# EAGLE design riffle-x9 (EAGLE 7.5.0)
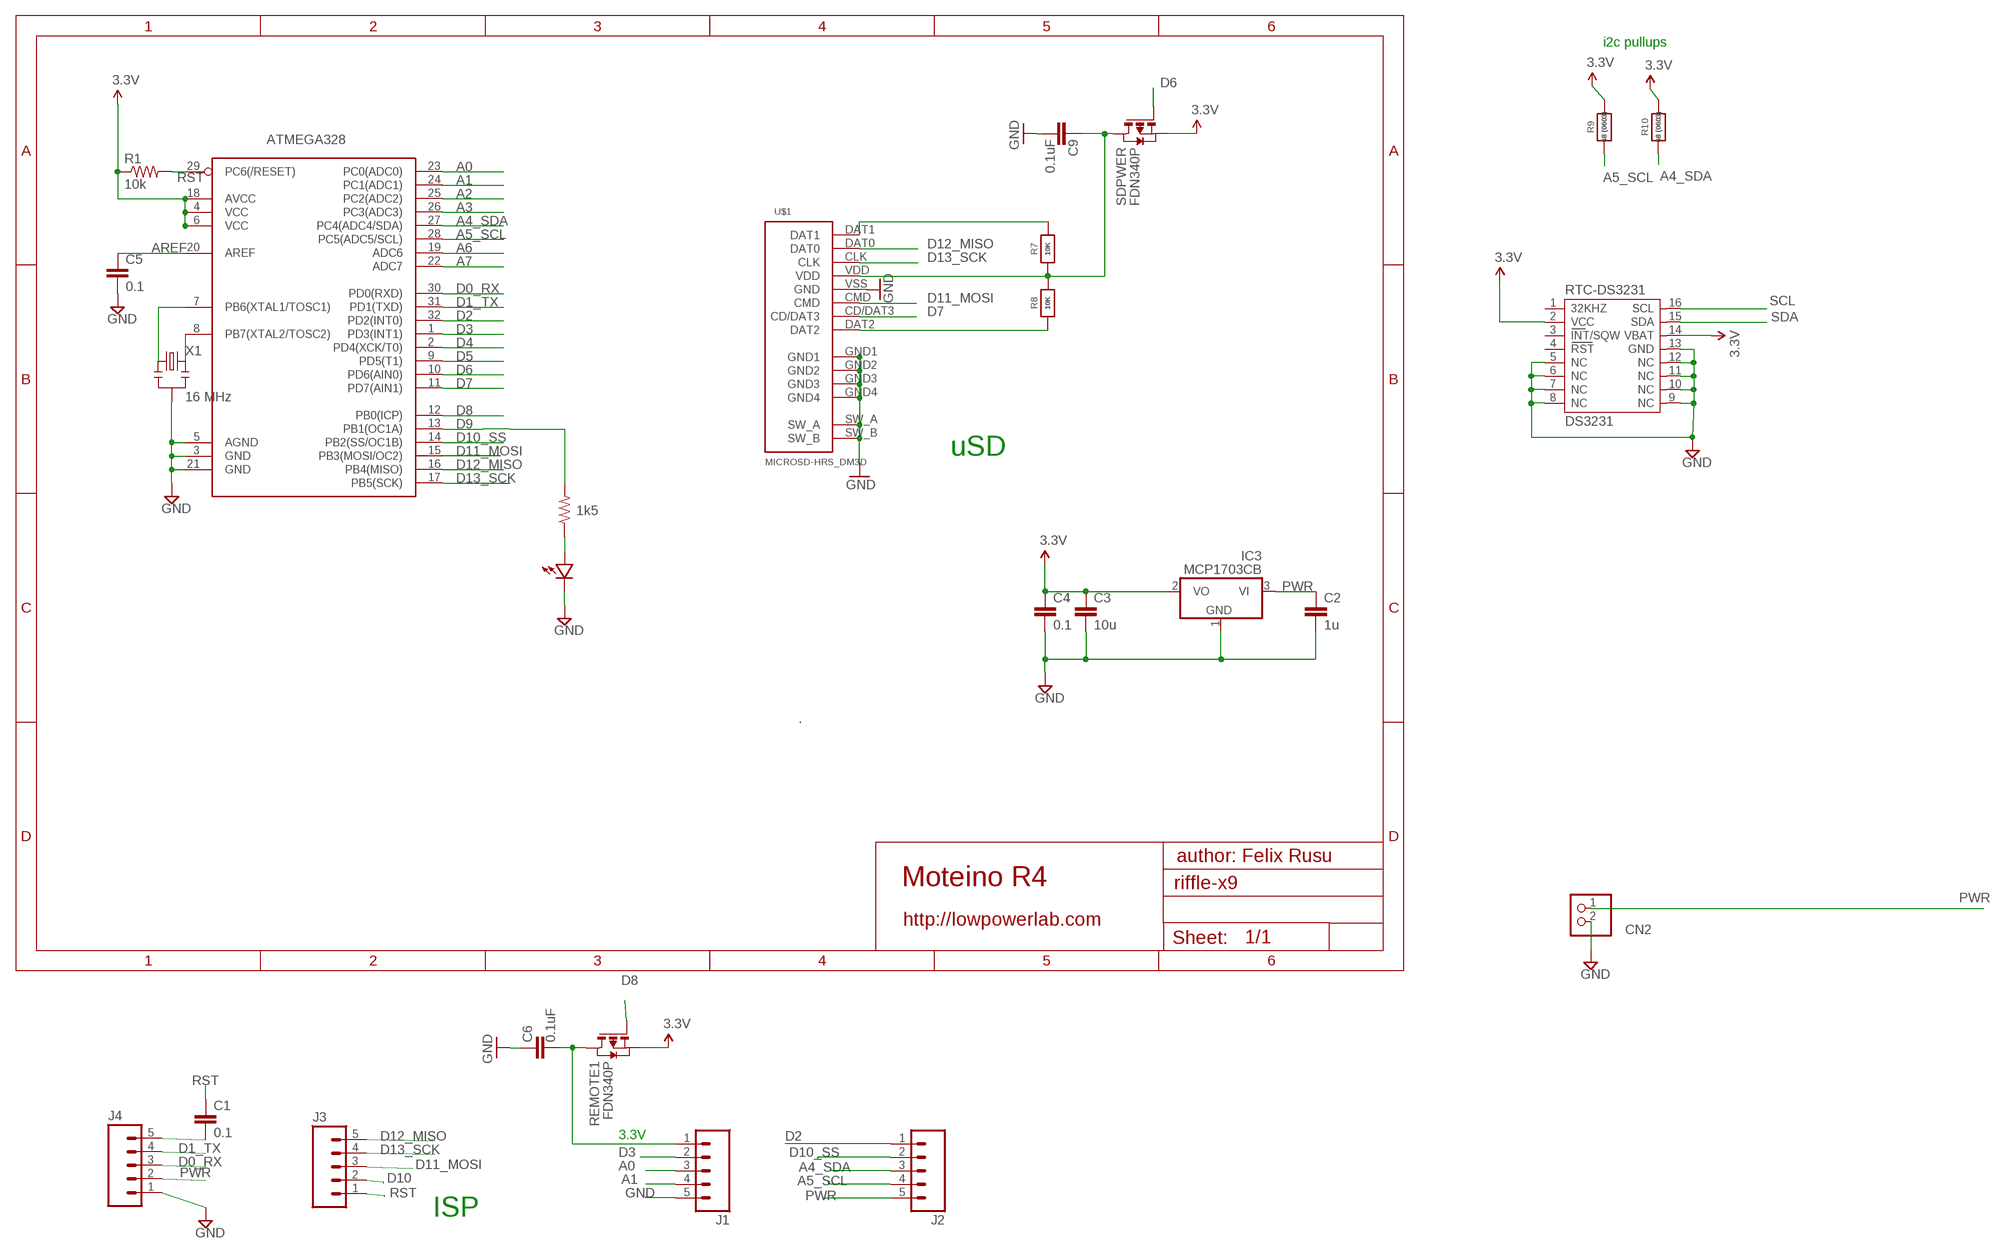
[diagram p0: schematic, sheet 1]

## Parts
ATMEGA328  ATMega-328  ATMEGA168/328TQFP32  [TQFP32-08]
C1  0.1  CAP0603-CAP  [0603-CAP]
C2  1u  CAP0603-CAP  [0603-CAP]
C3  10u  CAP0805-CAP  [0805-CAP]
C4  0.1  CAP0603-CAP  [0603-CAP]
C5  0.1  CAP0603-CAP  [0603-CAP]
C6  0.1uF  CAP0603-CAP  [0603-CAP]
C9  0.1uF  CAP0603-CAP  [0603-CAP]
CN2  JST_2PIN-SMT-RA  [JST-PH-2-SMT-RA]
IC3  MCP1703CB  [SOT23]
J1  M051.27MM  [1X05-1.27MM]
J2  M051.27MM  [1X05-1.27MM]
J3  M051.27MM  [1X05-1.27MM]
J4  M051.27MM  [1X05-1.27MM]
R1  10k  RESISTOR0603-RES  [0603-RES]
R2  1k5  RESISTOR0603-RES  [0603-RES]
R7  10K  RESISTOR_0603_NOOUT  [0603-NO]
R8  10K  RESISTOR_0603_NOOUT  [0603-NO]
R9  68 (0603)  RESISTOR_0603_NOOUT  [0603-NO]
R10  68 (0603)  RESISTOR_0603_NOOUT  [0603-NO]
REMOTE1  FDN340P  PMOSSOT23  [SOT-23]
RTC-DS3231  DS3231  [DS3231]
SDPWER  FDN340P  PMOSSOT23  [SOT-23]
U$1  MICROSD-HRS_DM3D  [DM3D]
U$2  LED0603  [0603-LED]
X1  16 MHz  RESONATORSMD  [RESONATOR-SMD]

## Nets
A0: ATMEGA328.23(PC0(ADC0)) J1.3
A1: ATMEGA328.24(PC1(ADC1)) J1.4
A2: ATMEGA328.25(PC2(ADC2))
A3: ATMEGA328.26(PC3(ADC3))
A4_SDA: ATMEGA328.27(PC4(ADC4/SDA)) J2.3 R10.1
A5_SCL: ATMEGA328.28(PC5(ADC5/SCL)) J2.4 R9.1
A6: ATMEGA328.19(ADC6)
A7: ATMEGA328.22(ADC7)
AREF: ATMEGA328.20(AREF) C5.1
D0_RX: ATMEGA328.30(PD0(RXD)) J4.3
D1_TX: ATMEGA328.31(PD1(TXD)) J4.4
D2: ATMEGA328.32(PD2(INT0)) J2.1
D3: ATMEGA328.1(PD3(INT1)) J1.2
D4: ATMEGA328.2(PD4(XCK/T0))
D5: ATMEGA328.9(PD5(T1))
D6: ATMEGA328.10(PD6(AIN0)) SDPWER.3(G)
D7: ATMEGA328.11(PD7(AIN1)) U$1.CD/DAT3
D8: ATMEGA328.12(PB0(ICP)) REMOTE1.3(G)
D9: ATMEGA328.13(PB1(OC1A)) R2.2
D10: J3.2
D10_SS: ATMEGA328.14(PB2(SS/OC1B)) J2.2
D11_MOSI: ATMEGA328.15(PB3(MOSI/OC2)) J3.3 U$1.CMD
D12_MISO: ATMEGA328.16(PB4(MISO)) J3.5 U$1.DAT0
D13_SCK: ATMEGA328.17(PB5(SCK)) J3.4 U$1.CLK
GND [power]: ATMEGA328.3(GND) ATMEGA328.5(AGND) ATMEGA328.21(GND) C2.2 C3.2 C4.2 C5.2 C6.2 C9.1 CN2.2 IC3.1(GND) J1.5 J4.1 RTC-DS3231.5(NC) RTC-DS3231.6(NC) RTC-DS3231.7(NC) RTC-DS3231.8(NC) RTC-DS3231.9(NC) RTC-DS3231.10(NC) RTC-DS3231.11(NC) RTC-DS3231.12(NC) RTC-DS3231.13(GND) U$1.GND1 U$1.GND2 U$1.GND3 U$1.GND4 U$1.SW_A U$1.SW_B U$1.VSS(GND) U$2.MINUS X1.2
N$1: ATMEGA328.7(PB6(XTAL1/TOSC1)) X1.1
N$2: R2.1 U$2.PLUS
N$3: C6.1 J1.1 REMOTE1.1(D)
N$4: C9.2 R7.1 R8.2 SDPWER.1(D) U$1.VDD
N$16: R7.2 U$1.DAT1
N$18: R8.1 U$1.DAT2
N$20: C1.2 J4.5
N$21: ATMEGA328.8(PB7(XTAL2/TOSC2)) X1.3
PWR [power]: C2.1 CN2.1 IC3.3(VI) J2.5 J4.2
RST: ATMEGA328.29(PC6(/RESET)) C1.1 J3.1 R1.2
SCL: RTC-DS3231.16(SCL)
SDA: RTC-DS3231.15(SDA)
VCC: ATMEGA328.4(VCC) ATMEGA328.6(VCC) ATMEGA328.18(AVCC) C3.1 C4.1 IC3.2(VO) R1.1 R9.2 R10.2 REMOTE1.2(S) RTC-DS3231.2(VCC) RTC-DS3231.14(VBAT) SDPWER.2(S) ; supply symbol labelled 3.3V
Unconnected: RTC-DS3231.1(32KHZ) RTC-DS3231.3(INT/SQW) RTC-DS3231.4(RST)

## Notes on the sheet
- i2c pullups
- uSD
- author: Felix Rusu
- Moteino R4
- http://lowpowerlab.com
- 3.3V
- ISP

## Library data of the parts
ATMEGA328 = LowPowerLab:ATMEGA168/328: Atmel 32-pin 8-bit micro, 16k flash.
C1-C5 = LowPowerLab:CAP: Capacitor Standard 0603 ceramic capacitor, and 0.1" leaded capacitor.
C6 C9 = SparkFun:CAP: Capacitor Standard 0603 ceramic capacitor, and 0.1" leaded capacitor.
CN2 = adafruit:JST_2PIN: JST 2-Pin Connectors of various flavors SMT-RA (S2B-PH-SM4) 4UConnector #17311 SMT (B2B-PH-SM4) THM-RA (S2B-PH) THM (B2B-PH)
IC3 = linear:MCP1703: 250 mA, 16V, Low Quiescent Current LDO Regulator Source: http://ww1.microchip.com/downloads/en/DeviceDoc/22049b.pdf
J1-J4 = SparkFun-Connectors:M05: Header 5 Standard 5-pin 0.1" header. Use with straight break away headers (SKU : PRT-00116), right angle break away headers (PRT-00553), swiss pins (PRT-00743), machine pins (PRT-00117), and female headers (PRT-00115). Molex polarized connector foot print use with SKU : PRT-08230 with associated crimp pins and housings.
R1 R2 = LowPowerLab:RESISTOR: Resistor Basic schematic elements and footprints for 0603, 1206, and PTH resistors.
R7-R10 = microbuilder:RESISTOR: Resistors For new designs, use the packages preceded by an '_' character since they are more reliable: The following footprints should be used on most boards: _0402 - Standard footprint for regular board layouts _0603 - Standard footprint for regular board layouts _0805 - Standard footprint for regular board layouts _1206 - Standard footprint for regular board layouts For extremely tight-pitch boards where space is at a premium, the following 'micro-pitch' footprints can be used (smaller pads, no silkscreen outline, etc.): _0402MP - Micro-pitch footprint for very dense/compact boards _0603MP - Micro-pitch footprint for very dense/compact boards _0805MP - Micro-pitch footprint for very dense/compact boards _1206MP - Micro-pitch footprint for very dense/compact boards
REMOTE1 SDPWER = zetex:PMOSSOT23: MOS FET; OC_FARNELL: unknown; OC_NEWARK: unknown
RTC-DS3231 = _lh-library:DS3231
U$1 = hrs_DM3D-SF:MICROSD-HRS_DM3D
U$2 = LowPowerLab:LED
X1 = SparkFun:RESONATOR: Resonator Small SMD resonator. This is the itty bitty 10/20MHz resonators with built in caps. CSTCE10M0G55 and CSTCE20M0V53. Footprint has been reviewed closely but hasn't been tested yet.

## Net classes
1 power: width 0.305 mm

## Board
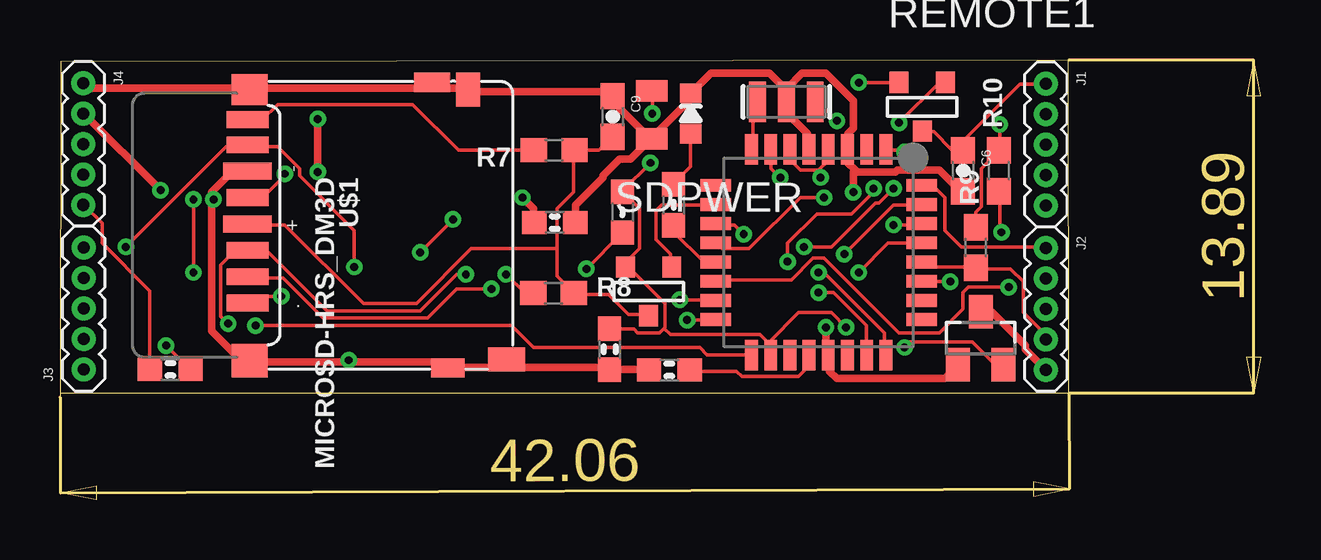
[diagram p1: board, top side]
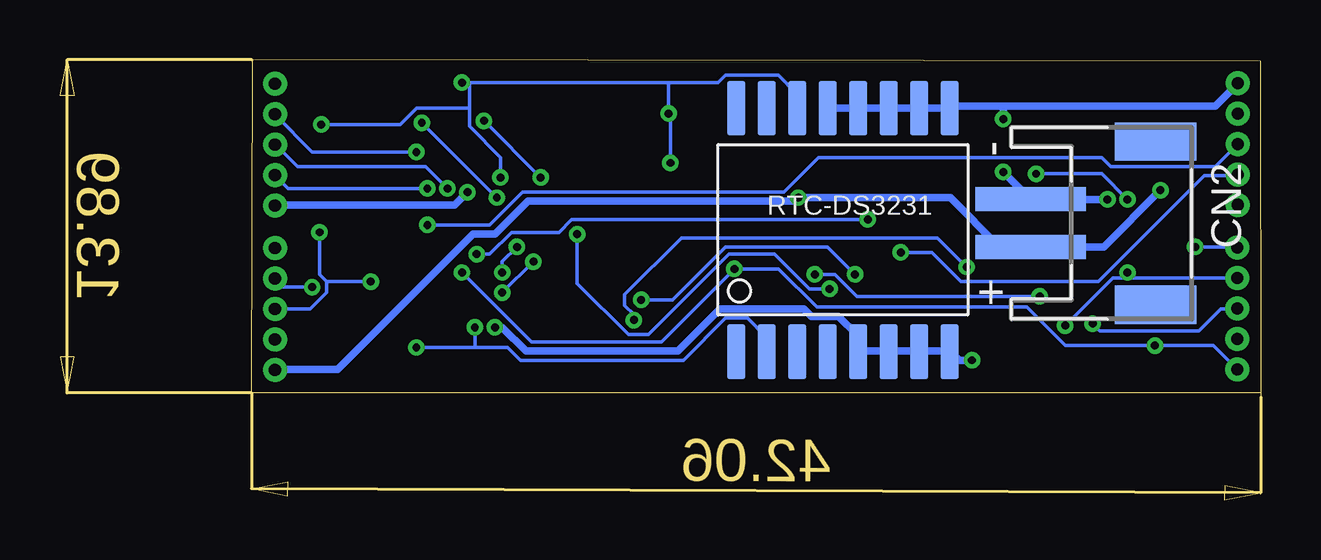
[diagram p2: board, bottom side, seen from below]

Size 42.06 x 14.07 mm. Coordinates in mm from the lower left corner, seen from the top.
Outline: 0,0 0.03,14.02 42.06,14.07
Outline: 0,0.18 42.06,0.18 42.04,14.07
Copper layers (1*16): Top 0.0356mm / dielectric 1.5011mm / Bottom 0.0356mm
Design rules "oshpark-2layer": minimum track width 6mil, minimum drill 13mil, track to track 6mil, track to pad 6mil, pad to pad 6mil, via to via 6mil, smd to smd 6mil, copper to edge 15mil, drill to drill 6mil, minimum pad ring 7mil, minimum via ring 7mil, stop-mask expansion 2.5mil, vias tented up to drill 0mil, thermal gap 10mil

### Footprints (pad centres in the part's own frame; a part is rotated, then mirrored left to right if it is on the bottom)
TQFP32-08 = smd 1.27 x 0.533: 1 -4.293,2.8; 2 -4.293,2; 3 -4.293,1.2; 4 -4.293,0.4; 5 -4.293,-0.4; 6 -4.293,-1.2; 7 -4.293,-2; 8 -4.293,-2.8; 17 4.293,-2.8; 18 4.293,-2; 19 4.293,-1.2; 20 4.293,-0.4; 21 4.293,0.4; 22 4.293,1.2; 23 4.293,2; 24 4.293,2.8 | smd 0.533 x 1.27: 9 -2.8,-4.293; 10 -2,-4.293; 11 -1.2,-4.293; 12 -0.4,-4.293; 13 0.4,-4.293; 14 1.2,-4.293; 15 2,-4.293; 16 2.8,-4.293; 25 2.8,4.293; 26 2,4.293; 27 1.2,4.293; 28 0.4,4.293; 29 -0.4,4.293; 30 -1.2,4.293; 31 -2,4.293; 32 -2.8,4.293
0603-CAP = smd 1.016 x 0.965: 1 -0.85,0; 2 0.85,0
0805-CAP = smd 0.902 x 1.3: 1 -1,0; 2 1,0
0603-CAP' = smd 1.1 x 1: 1 -0.85,0; 2 0.85,0
JST-PH-2-SMT-RA = smd 1 x 4.6: 1 1,-3.7; 2 -1,-3.7 | smd 1.6 x 3.4: NC1 -3.4,1.5; NC2 3.4,1.5
SOT23 = smd 1 x 1.4: 1 -0.95,-1.1; 2 0.95,-1.1; 3 0,1.1
1X05-1.27MM = drill 0.508 pad 1: 1 0,0; 2 1.27,0; 3 2.54,0; 4 3.81,0; 5 5.08,0
0603-RES = smd 1.016 x 0.965: 1 -0.85,0; 2 0.85,0
0603-NO = smd 1.1 x 1: 1 -0.85,0; 2 0.85,0
SOT-23 = smd 0.787 x 0.889: 1 0.025,-1.016; 2 -0.94,1.016; 3 0.991,1.016
DS3231 = smd 0.762 x 2.286: 1 -4.445,-5.08; 2 -3.175,-5.08; 3 -1.905,-5.08; 4 -0.635,-5.08; 5 0.635,-5.08; 6 1.905,-5.08; 7 3.175,-5.08; 8 4.445,-5.08; 9 4.445,5.08; 10 3.175,5.08; 11 1.905,5.08; 12 0.635,5.08; 13 -0.635,5.08; 14 -1.905,5.08; 15 -3.175,5.08; 16 -4.445,5.08
DM3D = smd 0.7 x 1.75: CD/DAT3 8.15,0.45; CLK 4.85,0.45; CMD 7.05,0.45; DAT0 2.65,0.45; DAT1 1.6,0.45; DAT2 9.25,0.45 | smd 0.8 x 1.5: GND1 0.05,8.15 | smd 0.8 x 1.4: GND2 11.95,8.8 | smd 1.4 x 1.5: GND3 11.65,0.55 | smd 1.3 x 1.5: GND4 0.35,0.55 | smd 1 x 1.55: SW_A 11.6,11.25 | smd 1.4 x 1: SW_B 0.35,9.65 | smd 0.7 x 2.032: VDD 5.95,0.45; VSS 3.75,0.45
0603-LED = smd 0.8 x 0.9: MINUS -0.85,0; PLUS 0.85,0
RESONATOR-SMD = smd 0.7 x 1.7: 1 -1.2,0; 2 0,0; 3 1.2,0

### Placement (x,y rotation side)
ATMEGA328  31.62,6.05 270 top
C1  4.6,1.17 180 top
C2  20.62,7.29 0 top
C3  24.66,11.79 270 top
C4  22.91,2.01 270 top
C5  25.4,1.14 180 top
C6  0.1uF  [0603-CAP']  37.64,9.45 270 top
C9  0.1uF  [0603-CAP']  23.04,11.71 270 top
CN2  5.89,7.26 270 bottom
IC3  38.38,2.46 0 top
J1  41.1,13.08 270 top
J2  41.1,6.22 270 top
J3  0.99,1.17 90 top
J4  0.97,13.11 270 top
R1  23.44,7.72 270 top
R2  25.58,8.03 270 top
R7  20.6,10.31 180 top
R8  20.57,4.34 0 top
R9  38.18,6.25 90 top
R10  39.14,9.45 90 top
REMOTE1  35.92,12.12 0 top
RTC-DS3231  17.42,6.99 0 bottom
SDPWER  24.51,4.42 0 top
U$1  7.37,13.18 270 top
U$2  26.29,11.84 270 top
X1  30.28,12.32 180 top

### Tracks (layer width: path | path; a pad name or v marks a point on that pad's centre or on a via)
A0  (via drill 0.33)
  Top 0.152: v31.62,4.37 32.23,4.37 33.6,3 33.6,1.78 ATMEGA328.23 | v30.33,5.66 30.33,6.43 31.55,7.65 32.99,7.65 33.91,8.56 v33.91,8.71
  Bottom 0.152: v30.33,5.66 v31.62,4.37 | v33.91,8.71 34.82,9.63 40.16,9.63 41.07,10.54 J1.3
A1  (via drill 0.33)
  Top 0.152: v31.62,5.21 31.85,5.21 34.37,2.69 34.37,1.78 ATMEGA328.24 | v31.01,6.27 32.16,6.27 33.98,8.1 34.14,8.1 v34.75,8.71
  Bottom 0.152: v31.62,5.21 31.62,5.66 v31.01,6.27 | v34.75,8.71 40.54,8.71 J1.4
A4_SDA  (via drill 0.33)
  Top 0.152: v39.24,6.88 39.17,6.96 39.17,8.56 R10.1 | v37.11,4.83 35.97,4.83 ATMEGA328.27
  Bottom 0.152: v39.24,6.88 39.24,5.13 38.94,4.83 | 38.94,4.83 38.94,4.37 39.62,3.68 J2.3 | 38.94,4.83 v37.11,4.83
A5_SCL
  Top 0.152: ATMEGA328.28 35.97,5.59 36.12,5.44 38.18,5.44 R9.1 38.18,5.36 39.62,5.36 40.16,4.83 40.16,3.53 41.07,2.62 41.07,2.46 J2.4
AREF
  Top 0.152: C5.1 26.29,1.09 28.19,1.09 28.42,0.86 30.79,0.86 31.17,1.24 31.17,1.7 ATMEGA328.20
D0_RX  (via drill 0.33)
  Top 0.152: v34.75,7.19 35.89,7.19 ATMEGA328.30
  Bottom 0.152: v34.75,7.19 32.16,7.19 30.79,8.56 19.89,8.56 18.44,10.01 6.63,10.01 6.25,9.63 1.91,9.63 J4.3
D1_TX  (via drill 0.33)
  Top 0.152: v32.69,5.97 34.75,8.03 35.89,8.03 ATMEGA328.31 | v15.01,6.04 v16.38,7.42
  Bottom 0.152: v32.69,5.97 32.16,5.97 31.24,6.88 29.26,6.88 28.73,7.42 v16.38,7.42 | v15.01,6.04 13.72,6.04 12.5,4.83 6.78,4.83 2.36,9.25 0.99,9.25 J4.4
D2
  Top 0.152: ATMEGA328.32 35.97,8.79 36.42,8.79 36.88,8.33 36.88,6.96 37.57,6.27 41.07,6.27 J2.1
D3  (via drill 0.33)
  Top 0.152: v35.2,10.24 35.13,10.31 34.44,10.31 ATMEGA328.1
  Bottom 0.152: v35.2,10.24 39.55,10.24 41.07,11.76 J1.2
D6
  Top 0.152: SDPWER.3 25.45,5.44 25.45,5.97 24.84,6.58 24.84,7.8 25.07,8.03 27.28,8.03 ATMEGA328.10
D7  (via drill 0.33)
  Top 0.152: v28.5,6.81 28.12,7.19 27.36,7.19 ATMEGA328.11 | v17.98,4.52 16.54,4.52 15.32,3.3 10.97,3.3 9.3,4.98 7.85,4.98 U$1.CD/DAT3
  Bottom 0.152: v28.5,6.81 28.5,4.75 26.36,2.62 25.53,2.62 22.17,5.97 20.27,5.97 18.82,4.52 v17.98,4.52
D8  (via drill 0.33)
  Top 0.152: REMOTE1.3 36.65,13.13 v34.98,11.46 | v31.85,8.33 30.86,8.33 28.73,6.2 27.58,6.2 27.36,6.43 ATMEGA328.12
  Bottom 0.152: v31.85,8.33 v34.98,11.46
D9
  Top 0.152: R2.2 25.6,7.11 25.6,6.88 26.82,5.66 27.28,5.66 ATMEGA328.13
D10_SS  (via drill 0.33)
  Top 0.152: v39.55,4.6 37.87,4.6 37.64,4.37 37.64,3.68 36.65,2.69 34.98,2.69 31.85,5.82 31.39,5.82 30.48,4.9 27.36,4.9 ATMEGA328.14
  Bottom 0.152: v39.55,4.6 40.77,4.6 41.07,4.9 J2.2
D11_MOSI  (via drill 0.33)
  Top 0.152: v25.83,4.06 27.28,4.06 ATMEGA328.15 | v16.92,5.13 16.54,5.13 15.01,3.61 11.12,3.61 8.61,6.12 7.85,6.12 U$1.CMD 7.77,6.12 7.32,6.12 6.71,5.51 6.71,3.38 v7.01,3.07
  Bottom 0.152: v25.83,4.06 24.54,4.06 22.33,6.27 18.06,6.27 v16.92,5.13 | v7.01,3.07 6.71,2.77 2.59,2.77 1.68,3.68 0.99,3.68 J3.3
D12_MISO  (via drill 0.33)
  Top 0.152: v26.14,3.23 27.28,3.23 ATMEGA328.16 | v12.27,5.44 12.27,6.96 9.98,9.25 9.98,9.55 9.07,10.46 7.85,10.46 U$1.DAT0 7.77,10.46 6.93,10.46 v2.74,6.27
  Bottom 0.152: v26.14,3.23 26.14,3.45 26.52,3.84 26.52,4.29 24.16,6.65 13.49,6.65 v12.27,5.44 | v2.74,6.27 0.99,6.27 J3.5
D13_SCK  (via drill 0.33)
  Top 0.152: v8.15,3 18.82,3 19.74,2.08 26.67,2.08 26.98,1.78 28.8,1.78 ATMEGA328.17 | v9.37,9.32 9.37,9.25 8.53,8.41 7.85,8.41 U$1.CLK | v5.56,5.21 v5.56,8.25
  Bottom 0.152: v8.15,3 6.17,4.98 5.56,4.98 | J3.4 5.56,4.98 | v9.37,9.32 6.63,9.32 v5.56,8.25 | 5.56,4.98 v5.56,5.21
GND  (via drill 0.33)
  Top 0.305: C5.2 24.54,1.17 22.94,1.17 C4.2 22.78,1.24 19.05,1.24 18.75,1.55 U$1.SW_A 18.59,1.55 18.29,1.24 16.23,1.24 U$1.GND2 16.08,1.32 15.93,1.47 12.04,1.47 | 12.04,1.47 7.92,1.47 U$1.GND3 7.77,1.55 7.54,1.55 6.33,2.77 6.33,8.25 | 6.33,8.25 6.33,8.56 7.16,9.4 7.77,9.4 U$1.VSS | v6.4,8.25 6.33,8.25 | IC3.1 37.41,1.32 36.88,0.79 32.38,0.79 32.08,1.09 32.08,1.7 ATMEGA328.21 31.93,1.85 v31.93,2.92 | v12.04,1.55 12.04,1.47 | J4.1 0.99,13.06 1.14,12.9 7.85,12.9 U$1.GND4 8,12.9 15.24,12.9 15.39,13.06 U$1.GND1 15.54,13.13 15.77,12.9 16.99,12.9 U$1.SW_B 17.14,12.75 22.86,12.75 22.94,12.67 C9.1 23.09,12.52 23.09,12.29 24.54,10.85 C3.2 | 33.15,9.47 32.84,9.78 32.84,10.31 ATMEGA328.3 32.84,10.46 32.84,11 33.07,11.23 33.07,12.37 31.93,13.51 30.94,13.51 30.33,12.9 X1.2 | 33.15,9.47 33.22,9.4 34.82,9.4 34.9,9.47 36.65,9.47 37.49,8.64 37.64,8.64 C6.2 | v33.07,8.56 33.07,9.4 33.15,9.47 | ATMEGA328.5 31.17,10.39 31.17,11 30.33,11.84 30.33,12.29 X1.2 | C3.2 24.69,10.85 26.29,12.45 U$2.MINUS 26.36,12.75 27.13,13.51 29.57,13.51 30.25,12.83 30.25,12.45 X1.2 | C2.2 21.49,7.34 21.49,8.03 22.63,9.17 22.63,9.25 23.32,9.93 23.77,9.93 24.54,10.69 C3.2 | v10.74,11.61 v10.74,9.4
  Bottom 0.305: v6.4,8.25 9.53,8.25 CN2.2 9.68,8.33 v10.74,9.4 | v31.93,2.92 31.62,2.92 30.63,1.93 24.31,1.93 22.55,3.68 19.05,3.68 18.75,3.38 17.6,3.38 16.84,2.62 16.84,2.01 RTC-DS3231.5 16.76,1.93 15.62,1.93 RTC-DS3231.6 15.47,1.93 14.33,1.93 RTC-DS3231.7 14.25,1.93 13.03,1.93 RTC-DS3231.8 12.88,1.85 12.57,1.55 v12.04,1.55 | RTC-DS3231.13 RTC-DS3231.12 RTC-DS3231.11 RTC-DS3231.10 RTC-DS3231.9 12.88,12.14 10.74,12.14 | 10.74,12.14 1.91,12.14 0.99,13.06 J4.1 | v33.07,8.56 33.6,8.03 41.07,8.03 J1.5 | 10.74,12.14 v10.74,11.61
N$1  (via drill 0.33)
  Top 0.152: v30.02,9.17 29.64,9.55 29.64,10.31 ATMEGA328.7 | v32.38,11.53 31.55,12.37 X1.1
  Bottom 0.152: v32.38,11.53 v30.02,9.17
N$2
  Top 0.152: U$2.PLUS 26.29,9.63 25.6,8.94 R2.1
N$3
  Top 0.152: 37.64,10.31 37.19,10.31 36.42,11.07 35.97,11.07 REMOTE1.1 | 37.64,10.31 37.64,10.69 40.01,13.06 41.07,13.06 J1.1 | 37.64,10.31 C6.1
N$4
  Top 0.152: C9.2 23.01,10.85 22.48,10.31 R7.1 21.41,10.31 21.41,8.56 20.73,7.87 20.73,6.2 | SDPWER.1 24.54,3.45 23.7,3.45 22.86,4.29 21.49,4.29 R8.2 21.41,4.37 20.73,5.05 20.73,6.2 | 20.73,6.2 17.14,6.2 14.86,3.91 12.65,3.91 9.37,7.19 7.85,7.19 U$1.VDD
N$16
  Top 0.152: R7.2 16.61,10.31 14.71,12.22 9.07,12.22 8.46,11.61 7.85,11.61 U$1.DAT1
N$18  (via drill 0.33)
  Top 0.152: v18.59,5.13 19.36,4.37 19.66,4.37 R8.1 | v9.22,4.22 8.08,4.22 7.85,3.99 U$1.DAT2
  Bottom 0.152: v18.59,5.13 17.75,5.13 16.84,4.22 v9.22,4.22
N$20
  Top 0.152: C1.2 3.73,1.17 3.73,4.44 1.75,6.43 1.75,7.26 0.99,8.03 J4.5
N$21
  Top 0.152: ATMEGA328.8 28.88,10.39 28.88,12.14 29.03,12.29 X1.3
PWR  (via drill 0.33)
  Top 0.305: J2.5 40.23,2.01 40.23,2.16 38.86,3.53 38.41,3.53 IC3.3 | v19.28,8.33 19.74,7.87 19.74,7.34 C2.1 | v4.19,8.64 0.99,11.84 J4.2
  Bottom 0.305: v4.19,8.64 6.55,6.27 9.45,6.27 CN2.1 9.6,6.27 10.9,6.27 12.95,8.33 v19.28,8.33 19.43,8.18 30.56,8.18 31.93,6.81 32.84,6.81 38.48,1.17 41.07,1.17 J2.5
RST  (via drill 0.33)
  Top 0.152: v4.42,2.16 5.41,1.17 C1.1 | v21.95,5.36 23.39,6.81 R1.2 | v33.3,5.21 34.52,6.43 35.89,6.43 ATMEGA328.29
  Bottom 0.152: J3.1 1.98,2.16 v4.42,2.16 8.15,2.16 9.75,3.76 18.52,3.76 20.12,5.36 v21.95,5.36 24.99,2.31 30.4,2.31 v33.3,5.21
VCC  (via drill 0.33)
  Top 0.152: v35.2,2.08 35.43,2.31 38.02,2.31 38.94,1.4 39.32,1.4 IC3.2 | 23.62,5.51 23.62,5.66 24.16,6.2 24.16,7.87 23.47,8.56 R1.1 23.47,8.64 v24.61,9.78 | 23.62,5.51 23.62,5.44 SDPWER.2 23.62,5.51 | 25.18,2.88 25.22,2.92 25.22,3.91 23.62,5.51 | 25.18,2.88 24.99,2.69 24.08,2.69 23.93,2.84 22.94,2.84 C4.1 | 25.18,2.88 25.45,2.62 29.18,2.62 29.57,2.23 29.57,1.78 ATMEGA328.18 29.57,2.31 30.79,3.53 32.16,3.53 v32.77,2.92 | R9.2 38.18,7.72 38.41,7.95 38.41,9.55 39.09,10.24 R10.2 39.17,10.31 v39.17,11.38 | 31.66,9.51 32,9.85 32,10.31 ATMEGA328.4 | 31.66,9.51 31.62,9.47 30.86,9.47 30.48,9.85 30.48,10.31 ATMEGA328.6 | v33.3,13.13 REMOTE1.2 | v24.69,11.84 24.69,12.75 C3.1 | v31.7,9.17 31.7,9.47 31.66,9.51
  Bottom 0.152: 32.77,2.08 31.39,2.08 30.86,1.55 24.08,1.55 22.33,3.3 21.41,3.3 20.65,2.54 20.65,1.93 RTC-DS3231.2 | 32.77,2.08 v35.2,2.08 | 24.69,13.13 22.63,13.13 22.33,13.44 20.12,13.44 19.36,12.67 19.36,12.06 RTC-DS3231.14 | 24.69,13.13 32.99,13.13 | 24.69,13.13 v24.69,11.84 24.61,11.76 v24.61,9.78 | v31.7,9.17 31.7,10.01 32.99,11.3 32.99,12.06 | 32.99,13.13 32.99,12.06 | 32.99,13.13 v33.3,13.13 | v39.17,11.38 35.89,11.38 35.2,12.06 32.99,12.06 | v32.77,2.92 32.77,2.08